# EAGLE design psx-mister (EAGLE 7.7.0)
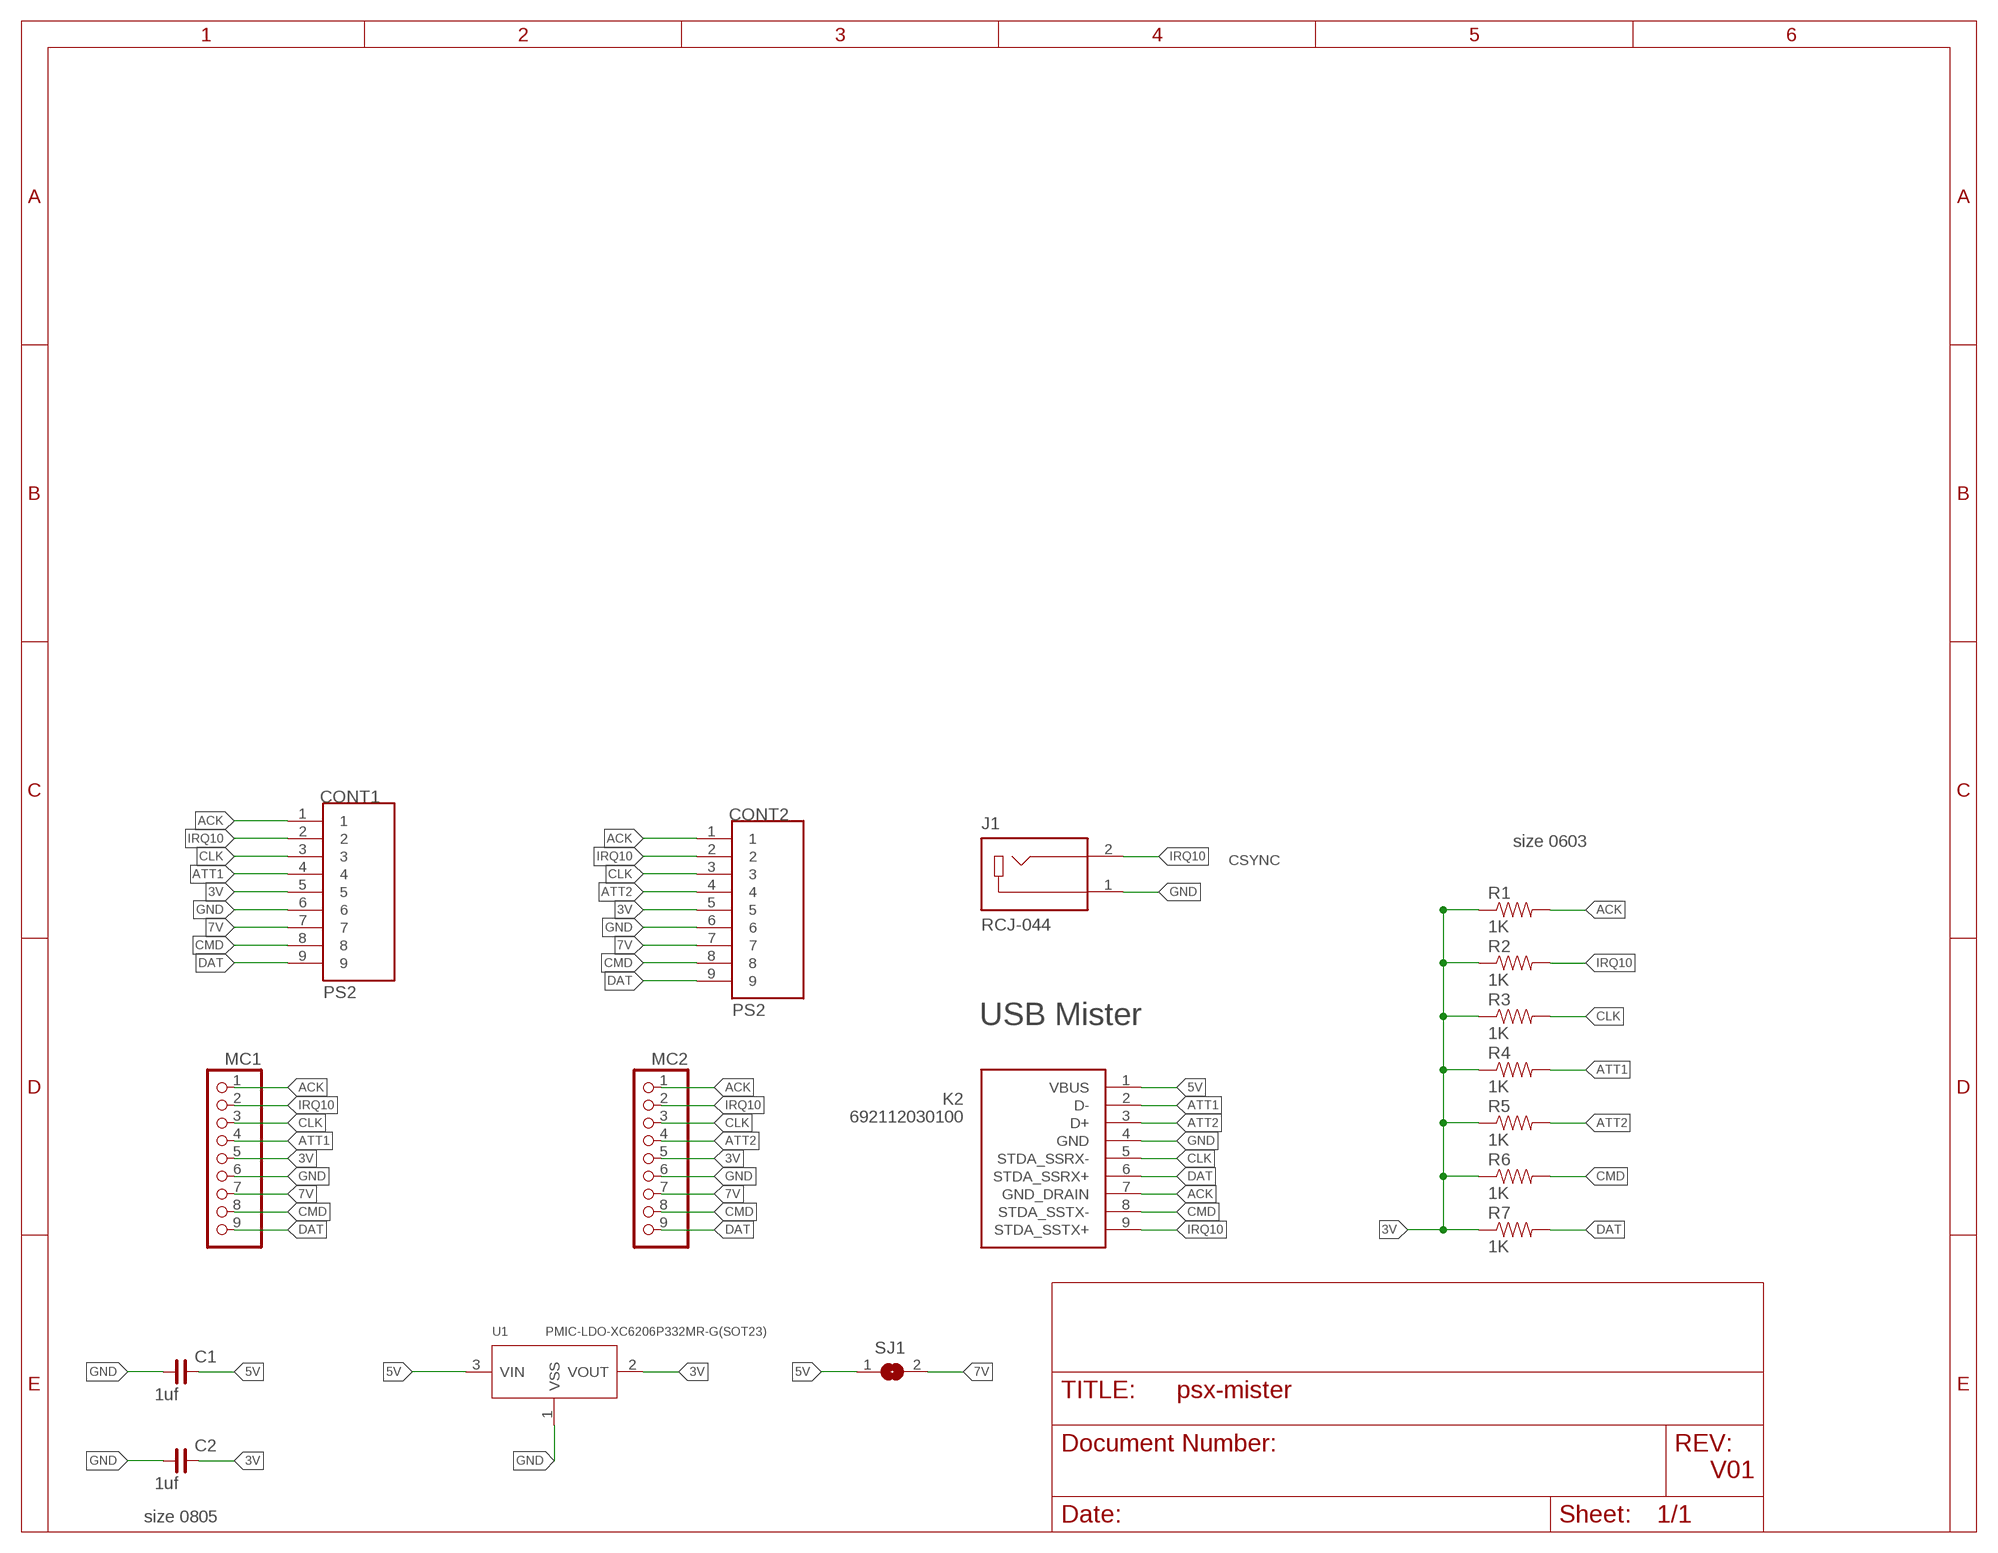
[diagram p0: schematic, sheet 1]

## Parts
C1  1uf  C_0805  [C0805]
C2  1uf  C_0805  [C0805]
CONT1  PS2  [TE_PS2]
CONT2  PS2  [TE_PS2]
J1  RCJ-044  [CUI_RCJ-044]
K2  692112030100  [692112030100]
MC1  PINHD-1X09_2.54-S  [1X09-S]
MC2  PINHD-1X09_2.54-S  [1X09-S]
R1  1K  RESISTOR0603-RES  [0603-RES]
R2  1K  RESISTOR0603-RES  [0603-RES]
R3  1K  RESISTOR0603-RES  [0603-RES]
R4  1K  RESISTOR0603-RES  [0603-RES]
R5  1K  RESISTOR0603-RES  [0603-RES]
R6  1K  RESISTOR0603-RES  [0603-RES]
R7  1K  RESISTOR0603-RES  [0603-RES]
SJ1  SJ  [SJ]
U1  PMIC-LDO-XC6206P332MR-G(SOT23)  [SOT-23]

## Nets
3V: C2.2 CONT1.5 CONT2.5 MC1.5 MC2.5 R1.1 R2.1 R3.1 R4.1 R5.1 R6.1 R7.1 U1.2(VOUT)
5V: C1.2 K2.1(VBUS) SJ1.1 U1.3(VIN)
7V: CONT1.7 CONT2.7 MC1.7 MC2.7 SJ1.2
ACK: CONT1.1 CONT2.1 K2.7(GND_DRAIN) MC1.1 MC2.1 R1.2
ATT1: CONT1.4 K2.2(D-) MC1.4 R4.2
ATT2: CONT2.4 K2.3(D+) MC2.4 R5.2
CLK: CONT1.3 CONT2.3 K2.5(STDA_SSRX-) MC1.3 MC2.3 R3.2
CMD: CONT1.8 CONT2.8 K2.8(STDA_SSTX-) MC1.8 MC2.8 R6.2
DAT: CONT1.9 CONT2.9 K2.6(STDA_SSRX+) MC1.9 MC2.9 R7.2
GND: C1.1 C2.1 CONT1.6 CONT2.6 J1.1 K2.4(GND) MC1.6 MC2.6 U1.1(VSS)
IRQ10: CONT1.2 CONT2.2 J1.2 K2.9(STDA_SSTX+) MC1.2 MC2.2 R2.2

## Notes on the sheet
- size 0603
- CSYNC
- USB Mister
- V01
- size 0805

## Library data of the parts
C1 C2 = rc-master-smd:C_: NON-POLARIZED CAP
CONT1 CONT2 = ps2con:PS2: Check prices <https://pricing.snapeda.com/parts/PS2/TE%20Connectivity/view-part?ref=eda>; AVAILABILITY: In Stock; COMMENT: PS2; DESCRIPTION: Connector Header Through Hole 9 position 0.156 (3.96mm); MF: TE Connectivity; MP: PS2; PACKAGE: None; PRICE: None; PURCHASE-URL: https://pricing.snapeda.com/search/part/PS2/?ref=eda
J1 = RCJ-044:RCJ-044: Metal Right-Angle, RCA Jack, Yellow Housing and Insulation Check prices <https://pricing.snapeda.com/parts/RCJ-044/CUI%20Devices/view-part?ref=eda>; AVAILABILITY: In Stock; CUI_PURCHASE_URL: https://www.cuidevices.com/product/interconnect/connectors/rca-connectors/rcj-04-series?utm_source=snapeda.com&utm_medium=referral&utm_campaign=snapedaBOM; DESCRIPTION: Metal Right-Angle, RCA Jack, Yellow Housing and Insulation; MF: CUI Devices; MP: RCJ-044; PACKAGE: None; PRICE: None; PURCHASE-URL: https://pricing.snapeda.com/search/part/RCJ-044/?ref=eda
K2 = Wuerth_Elektronik_eiCan_Communication_Connectors_STENCIL:692112030100: WR-COM USB 3.0 SMT PLUG WITH CLIPTYPE A
MC1 MC2 = pinhead-2:PINHD-1X09: PIN HEADER
R1-R7 = SparkFun:RESISTOR: Resistor Basic schematic elements and footprints for 0603, 1206, and PTH resistors.
SJ1 = jumper:SJ: SMD solder JUMPER
U1 = PMIC-LDO-XC6206P332MR-G_SOT23_:PMIC-LDO-XC6206P332MR-G(SOT23): 310030099; AVAILABILITY: Unavailable; DESCRIPTION: SMD PMIC; LDO; Vin 6V; 3.3V; 200mA; Without En; 1-Ch; MF: Torex; MP: XC6206P332MR-G; PACKAGE: SOT-23-3 Torex; PRICE: None

## Board
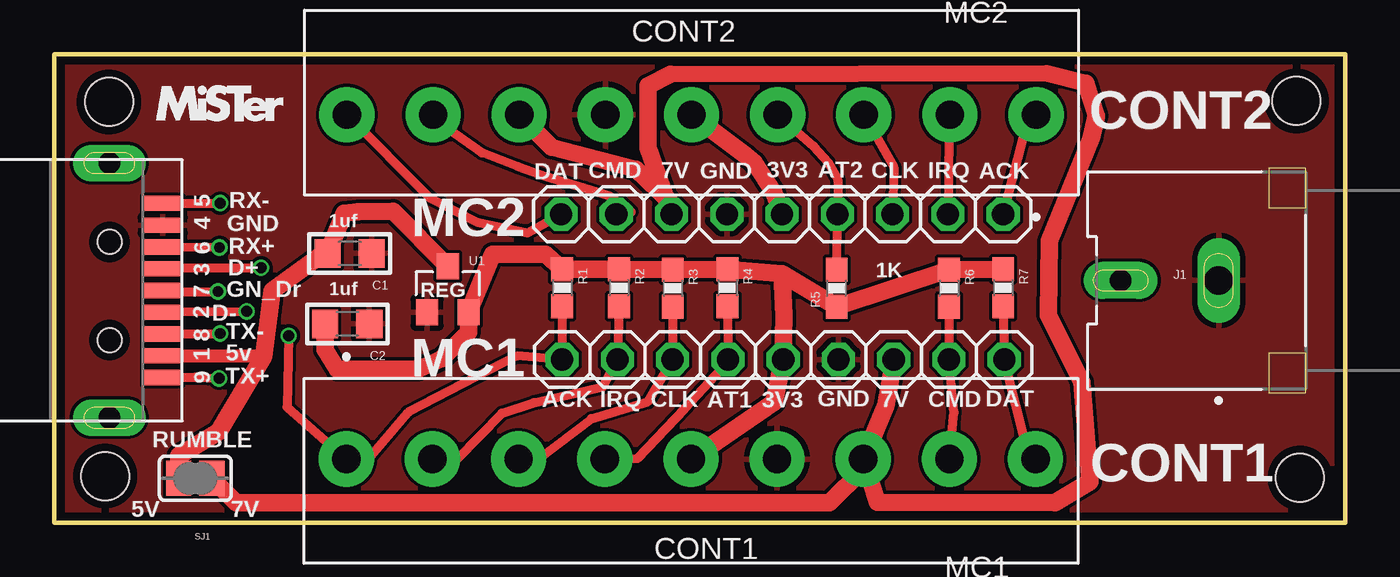
[diagram p1: board, top side]
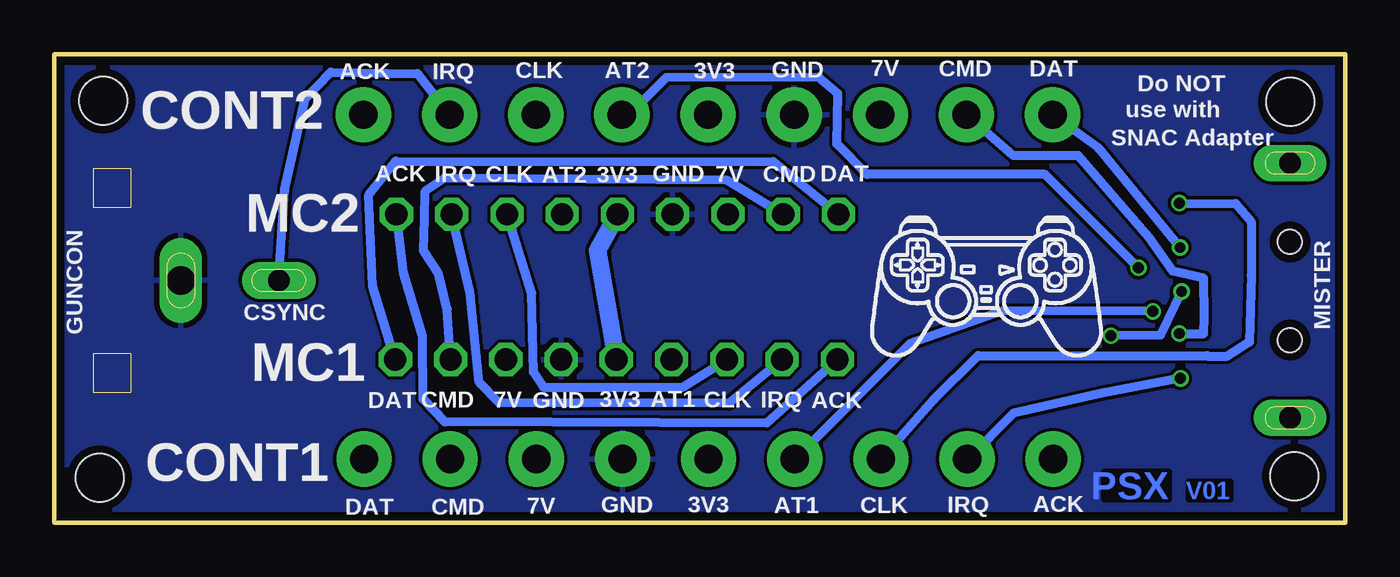
[diagram p2: board, bottom side, seen from below]

Size 59.33 x 21.51 mm. Coordinates in mm from the lower left corner, seen from the top.
Outline: 0,0 59.33,0 59.33,21.51 0,21.51 0,0
Copper layers (1*16): Top 0.035559375mm / dielectric 1.6mm / Bottom 0.035559375mm
Design rules "oshpark-2layer": minimum track width 6mil, minimum drill 10mil, track to track 6mil, track to pad 6mil, pad to pad 6mil, via to via 6mil, smd to smd 6mil, copper to edge 15mil, drill to drill 6mil, minimum pad ring 5mil, minimum via ring 5mil, stop-mask expansion 2.5mil, vias tented up to drill 0mil, thermal gap 10mil
Holes 2.2 mm at 57.25,2.06 2.51,19.33 57.1,19.38 2.34,2.13
Holes 1.1 mm at 2.54,12.9 2.54,8.38

### Footprints (pad centres in the part's own frame; a part is rotated, then mirrored left to right if it is on the bottom)
C0805 = smd 1.2 x 1.3: 1 -1.016,0; 2 1.016,0
TE_PS2 = drill 1.3 pad 2.54: 1 -15.84,0; 2 -11.88,0; 3 -7.92,0; 4 -3.96,0; 5 0,0; 6 3.96,0; 7 7.92,0; 8 11.88,0; 9 15.84,0
CUI_RCJ-044 = drill 1.3 long: 1 0,0 | drill 1 pad 1.7 long: 2 -4.5,0
692112030100 = smd 0.7 x 1.8: 1 -3,0; 2 -1,0; 3 1,0; 4 3,0; 5 4,0; 6 2,0; 7 0,0; 8 -2,0; 9 -4,0 | drill 1 pad 1.676 long: Z1 5.85,2.45; Z2 -5.85,2.45
1X09-S = drill 1.016 octagon: 1 -10.16,0; 2 -7.62,0; 3 -5.08,0; 4 -2.54,0; 5 0,0; 6 2.54,0; 7 5.08,0; 8 7.62,0; 9 10.16,0
0603-RES = smd 1.1 x 1: 1 -0.85,0; 2 0.85,0
SJ = smd 1.168 x 1.6: 1 -0.762,0; 2 0.762,0
SOT-23 = smd 1.016 x 1.2: 1 -0.95,-1.06; 2 0.95,-1.06; 3 0,1.06

### Placement (x,y rotation side)
C1  13.57,12.37 180 top
C2  13.46,9.13 180 top
CONT1  29.26,2.92 0 top
CONT2  29.29,18.75 180 top
J1  53.52,11.13 0 top
K2  4.98,10.67 90 top
MC1  33.5,7.49 0 top
MC2  33.45,14.17 180 top
R1  23.34,10.79 270 top
R2  25.96,10.79 270 top
R3  28.42,10.77 270 top
R4  30.94,10.79 270 top
R5  35.97,10.77 90 top
R6  41.12,10.77 270 top
R7  43.61,10.79 270 top
SJ1  6.48,2.03 0 top
U1  18.08,10.72 0 top

### Tracks (layer width: path | path; a pad name or v marks a point on that pad's centre or on a via)
3V
  Top 0.61: 16.74,7.04 16.79,7.04
  Top 0.813: CONT1.5 33.07,5.54 MC1.5 33.53,9.53 33.45,11.43 | CONT2.5 31.78,16.89 32.18,16.54 33.07,15.16 MC2.5 | C2.2 12.45,7.95 13,7.04 16.74,7.04 17.81,7.52 19.03,8.75 U1.2 20.15,12.32 22.58,12.32 R1.1 R2.1 R3.1 R4.1 33.45,11.43 | 33.45,11.43 R5.1 R6.1 R7.1
  Bottom 0.813: MC2.5 34.37,12.52 MC1.5
5V
  Top 0.61: K2.1 9.63,7.64
  Top 0.813: U1.3 15.56,14.3 13.97,14.28 13.32,14.21 C1.2 12.37,12.37 10.01,10.64 9.63,7.64 7.54,4.17 5.72,3.07 SJ1.1
7V
  Top 0.762: 47.42,20.19 45.59,20.65 28.32,20.6
  Top 0.813: CONT1.7 38.23,5.39 MC1.7 | CONT2.7 22.86,17.25 26.75,16.23 28.3,14.73 MC2.7 27.28,17.22 27.28,20.07 28.32,20.6 | SJ1.2 8.36,0.91 35.64,0.91 37.18,2.46 CONT1.7 | CONT1.7 37.85,0.94 46,0.91 47.6,1.88 47.24,6.45 45.69,9.53 45.75,12.95 47.68,17.68 47.9,18.69 47.42,20.19
ACK  (via drill 0.5)
  Top 0.406: CONT2.1 44.68,18.3 MC2.1 | K2.7 4.93,10.62 v7.52,10.62 | v10.77,8.59 10.69,5.31 CONT1.1 14.43,2.92 16.27,5.07 21.27,7.66 MC1.1 R1.2
  Bottom 0.406: MC1.1 26.59,4.57 41.38,4.62 42.39,5.69 42.42,8.56 43.28,11.46 MC2.1 | v7.52,10.62 8.48,8.61 v10.77,8.59
ATT1  (via drill 0.5)
  Top 0.406: CONT1.4 26.8,2.95 28.96,5.23 30.63,7.04 MC1.4 R4.2 | K2.2 v8.84,9.7
  Bottom 0.406: v8.84,9.7 15.75,9.73 19.99,8.23 CONT1.4
ATT2  (via drill 0.5)
  Top 0.406: CONT2.4 34.9,17.3 35.56,16.56 36.02,15.75 MC2.4 R5.2 | K2.3 5.02,11.71 v9.5,11.71
  Bottom 0.406: v9.5,11.71 13.79,16 21.97,16 23.37,17.4 23.32,19.71 24.21,20.47 31.22,20.45 32.92,18.75 CONT2.4
CLK  (via drill 0.5)
  Top 0.406: CONT1.3 22.23,2.92 24.69,4.78 27.28,5.56 MC1.3 R3.2 | CONT2.3 38.58,16.33 MC2.3 | K2.5 6.26,14.67 v7.62,14.68
  Bottom 0.406: MC1.3 30.43,6.22 36.86,6.22 37.31,6.91 37.39,10.54 MC2.3 | v7.62,14.68 5.03,14.66 4.32,13.82 4.32,11.35 4.39,8.31 5.44,7.64 6.32,7.64 6.35,7.67 16.87,7.67 18.9,5.66 CONT1.3
CMD  (via drill 0.5)
  Top 0.406: CONT1.8 41.35,5.06 MC1.8 R6.2 | MC2.8 26.52,14.28 25.55,14.99 24.36,15.37 22.61,15.9 21.31,16.36 19.66,16.99 17.41,18.59 CONT2.8 | K2.8 5,8.69 v7.62,8.69
  Bottom 0.406: MC2.8 28.45,15.75 41.38,15.85 42.29,15.21 42.32,13.97 42.37,12.5 41.68,11.43 41.28,9.8 MC1.8 | v7.62,8.69 6.5,8.69 6.48,9.47 6.5,11.23 7.92,11.56 9.02,13.11 12.27,16.87 15.25,16.87 CONT2.8
DAT  (via drill 0.5)
  Top 0.406: CONT1.9 44.73,3.29 MC1.9 R7.2 | CONT2.9 17.26,14.94 19.46,13.79 21.74,13.31 MC2.9 | K2.6 v7.59,12.64
  Bottom 0.406: MC1.9 44.7,10.87 44.88,15.06 43.64,16.61 26.29,16.59 MC2.9 | v7.59,12.64 11.33,17.2 CONT2.9
GND
  pour Top: -0.03,21.51 59.23,21.49 59.36,-0.05 0,0
  pour Bottom: -0.03,21.49 59.28,21.56 59.36,-0.05 -0.03,0
IRQ10  (via drill 0.5)
  Top 0.406: CONT1.2 18.52,2.92 20.57,5.03 22.05,5.51 25.22,6.25 MC1.2 R2.2 | CONT2.2 41.12,17.7 MC2.2 | K2.9 6.49,6.68 v7.57,6.63
  Bottom 0.406: MC1.2 28.32,5.49 38.89,5.51 39.8,6.45 40.23,10.57 MC2.2 | v7.57,6.63 11.18,5.94 15.24,5.03 17.35,2.92 CONT1.2 | J1.2 48.74,15.29 47.8,19.48 46.63,20.7 42.65,20.62 CONT2.2

### Text on the board
Bottom: V01 | PSX
tPlace: CONT2 | DAT | CMD | 7V | GND | 3V3 | AT2 | CLK | IRQ | ACK | 5 | RX- | 1uf | 4 | GND | MC2 | 6 | RX+ | 1K | 3 | D+ | 1uf | REG | 7 | GN_Dr | 2 | D- | 8 | TX- | 1 | 5v | MC1 | 9 | TX+ | ACK | IRQ | CLK | AT1 | 3V3 | GND | 7V | CMD | DAT | RUMBLE | CONT1 | 5V | 7V
bPlace: DAT | CMD | 7V | GND | 3V3 | AT2 | CLK | IRQ | ACK | Do NOT | use with | SNAC Adapter | CONT2 | DAT | CMD | 7V | GND | 3V3 | AT2 | CLK | IRQ | ACK | MISTER | MC2 | GUNCON | CSYNC | MC1 | ACK | IRQ | CLK | AT1 | 3V3 | GND | 7V | CMD | DAT | CONT1 | ACK | IRQ | CLK | AT1 | 3V3 | GND | 7V | CMD | DAT
tValues: + | -